# EasyEDA schematic Skateboard.json
TITLE: Skateboard; REV: 1.0; Date: 2020-12-23; Sheet: 1/1; Company: Your Company
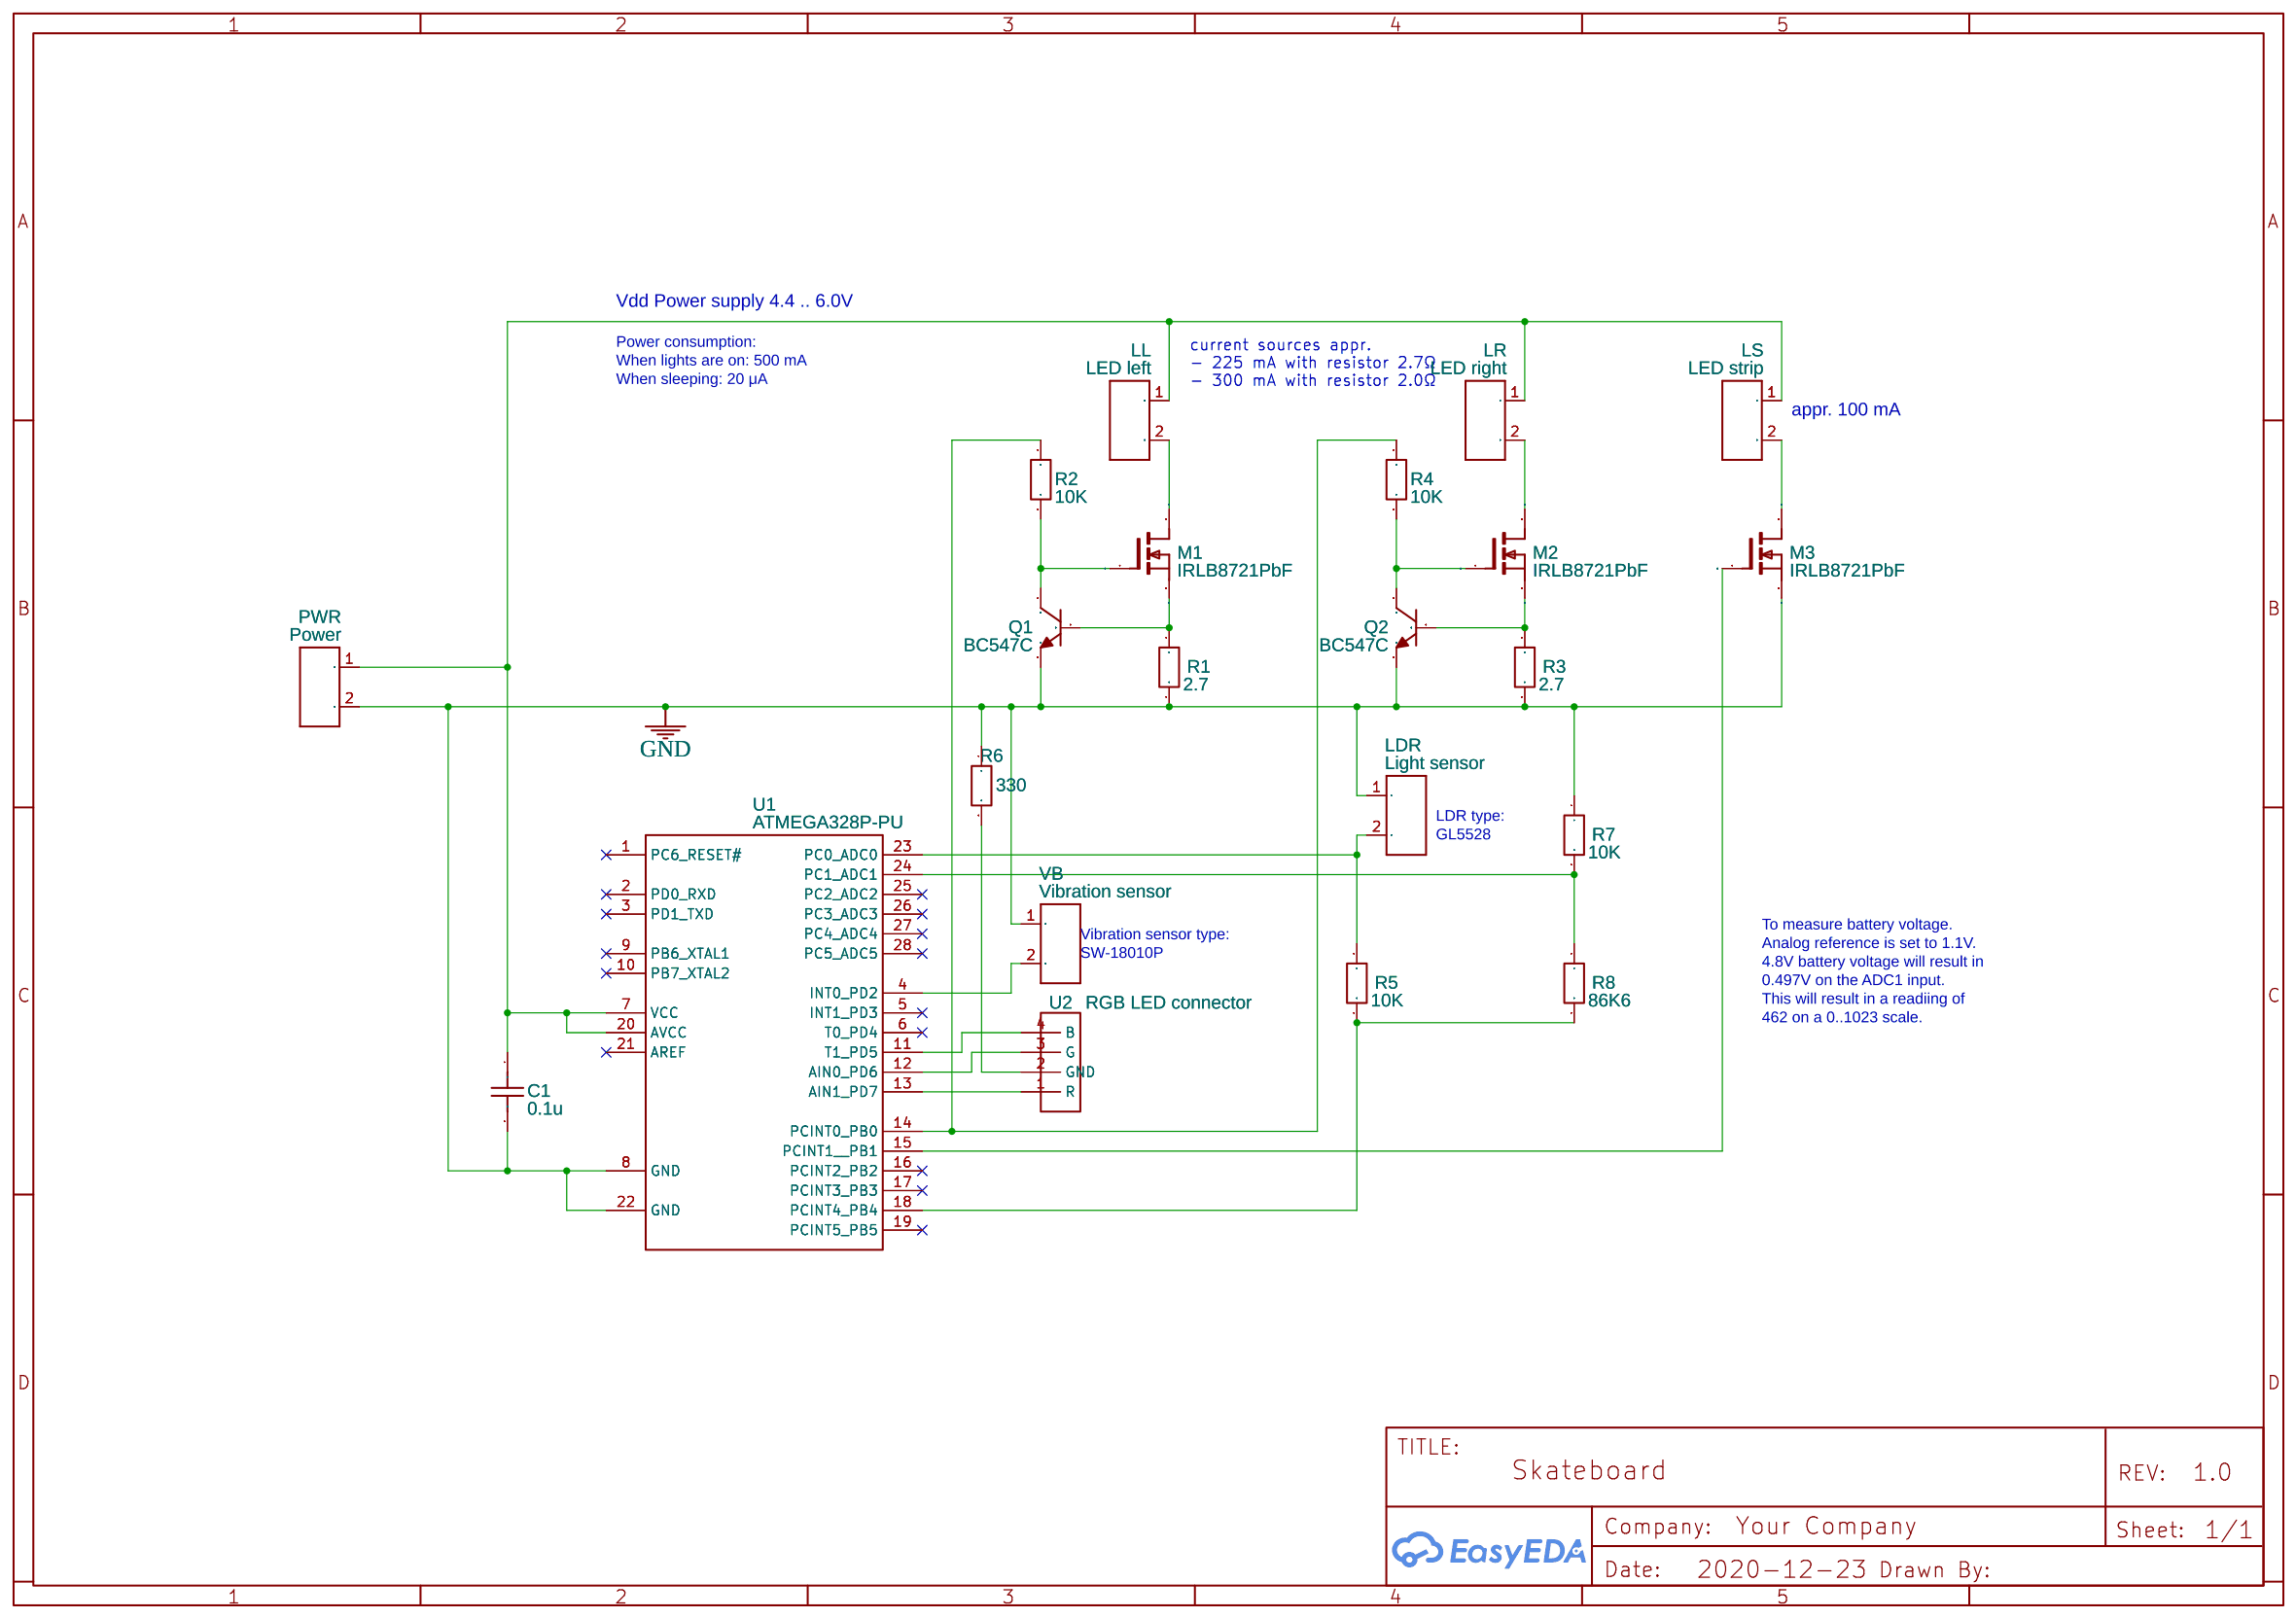
[diagram p0: schematic sheet]

## Parts
C1  0.1u  [CONDENSATOR 0.1UF]
LDR  Light sensor  [H2-5.0-10.5X8.0MM]
LL  LED left  [H2-5.0-10.5X8.0MM]
LR  LED right  [H2-5.0-10.5X8.0MM]
LS  LED strip  [H2-5.0-10.5X8.0MM]
M1  IRLB8721PbF  [T0220AB]
M2  IRLB8721PbF  [T0220AB]
M3  IRLB8721PbF  [T0220AB]
PWR  Power  [H2-5.0-10.5X8.0MM]
Q1  BC547C  [TO-92-3_L4.9-W3.7-P1.27-L]
Q2  BC547C  [TO-92-3_L4.9-W3.7-P1.27-L]
R1  2.7  [RESISTOR-1/4W-HORIZONTAL]
R2  10K  [RESISTOR-1/4W-HORIZONTAL]
R3  2.7  [RESISTOR-1/4W-HORIZONTAL]
R4  10K  [RESISTOR-1/4W-HORIZONTAL]
R5  10K  [RESISTOR-1/4W-HORIZONTAL]
R6  330  [RESISTOR-1/4W-HORIZONTAL]
R7  10K  [RESISTOR-1/4W-HORIZONTAL]
R8  86K6  [RESISTOR-1/4W-HORIZONTAL]
U1  ATMEGA328P-PU  [DIP-28_L34.6-W7.3-P2.54-LS10.2-BL]
U2  RGB LED connector  [RGB LED CONNECTOR]
VB  Vibration sensor  [H2-5.0-10.5X8.0MM]

## Library data of the parts
C1 = C_0603_US: Contributor: LCEDA_Lib
LDR LL LR LS PWR VB = Screw Terminal: Manufacturer Part: ?
M1-M3 = BSS123: Contributor: EasyEDA
Q1 Q2 = BC547C: Supplier: LCSC; Supplier Part: C713614; Manufacturer: LGE; Contributor: LCSC
R1-R8 = Resistor_EU: Contributor: EasyEDA; Resistance: 1K
U1 = ATMEGA328P-PU: sourceId: Oic6oiASL; Supplier: LCSC; Manufacturer: MICROCHIP; image: //image.lceda.cn/szlcsc/C33901.jpg; Contributor: LCSC; Supplier Part: C33901
U2 = RGB LED connector: Contributor: Guest

## Nets
GND: C1.2 LDR.1 M3.3(S) PWR.2 Q1.3(E) Q2.3(E) R1.2 R3.2 R6.1 R7.1 U1.8(GND) U1.22(GND) VB.1
Net-(C1-1): C1.1 LL.1 LR.1 LS.1 PWR.1 U1.7(VCC) U1.20(AVCC)
Net-(LDR-2): LDR.2 R5.1 U1.23(PC0 ADC0)
Net-(LL-2): LL.2 M1.2(D)
Net-(LR-2): LR.2 M2.2(D)
Net-(LS-2): LS.2 M3.2(D)
Net-(M1-1): M1.1(G) Q1.1(C) R2.2
Net-(M1-3): M1.3(S) Q1.2(B) R1.1
Net-(M2-1): M2.1(G) Q2.1(C) R4.2
Net-(M2-3): M2.3(S) Q2.2(B) R3.1
Net-(M3-1): M3.1(G) U1.15(PCINT1  PB1)
Net-(R2-1): R2.1 R4.1 U1.14(PCINT0 PB0)
Net-(R5-2): R5.2 R8.2 U1.18(PCINT4 PB4)
Net-(R6-2): R6.2 U2.2(GND)
Net-(R7-2): R7.2 R8.1 U1.24(PC1 ADC1)
Net-(U1-4): U1.4(INT0 PD2) VB.2
Net-(U1-11): U1.11(T1 PD5) U2.4(B)
Net-(U1-12): U1.12(AIN0 PD6) U2.3(G)
Net-(U1-13): U1.13(AIN1 PD7) U2.1(R)

Not connected (* = marked no-connect by the designer): U1 1(PC6 RESET#)* 2(PD0 RXD)* 3(PD1 TXD)* 5(INT1 PD3)* 6(T0 PD4)* 9(PB6 XTAL1)* 10(PB7 XTAL2)* 16(PCINT2 PB2)* 17(PCINT3 PB3)* 19(PCINT5 PB5)* 21(AREF)* 25(PC2 ADC2)* 26(PC3 ADC3)* 27(PC4 ADC4)* 28(PC5 ADC5)*

## Notes on the sheet
- Vdd Power supply 4.4 .. 6.0V
- Power consumption:
  When lights are on: 500 mA
  When sleeping: 20 μA
- current sources appr.
  - 225 mA with resistor 2.7Ω
  - 300 mA with resistor 2.0Ω
- appr. 100 mA
- LDR type:
  GL5528
- Vibration sensor type:
  SW-18010P
- To measure battery voltage.
  Analog reference is set to 1.1V.
  4.8V battery voltage will result in
  0.497V on the ADC1 input.
  This will result in a readiing of
  462 on a 0..1023 scale.
